# Altium schematic sheet Probe-Scope Top v1.0.SchDoc: Probe-Scope: Overview
size Letter; CompanyName: Probe-Scope; Organization: Probe-Scope; Address1: Probe-Scope: Unified USB; Address2: Oscilloscope Probe; Address3: ©2019 M. Omo, J. Rowley,; SheetNumber: 1; PageSetup: Record=PageOptions|CenterHorizontal=True|CenterVertical=True|PrintScale=0.96|XCorrection=1.00|YCorrection=1.00|PrintKind=1|BorderSize=5000000|LeftOffset=0|BottomOffset=0|Orientation=2|PaperLength=1000|PaperWidth=1000|Scale=100|PaperSource=7|PrintQuality=-4|MediaType=1|DitherType=10|PaperKind=11x17|PrintScaleMode=1; Address4: K. Hall, released under the; License: CERN OHL v1.2
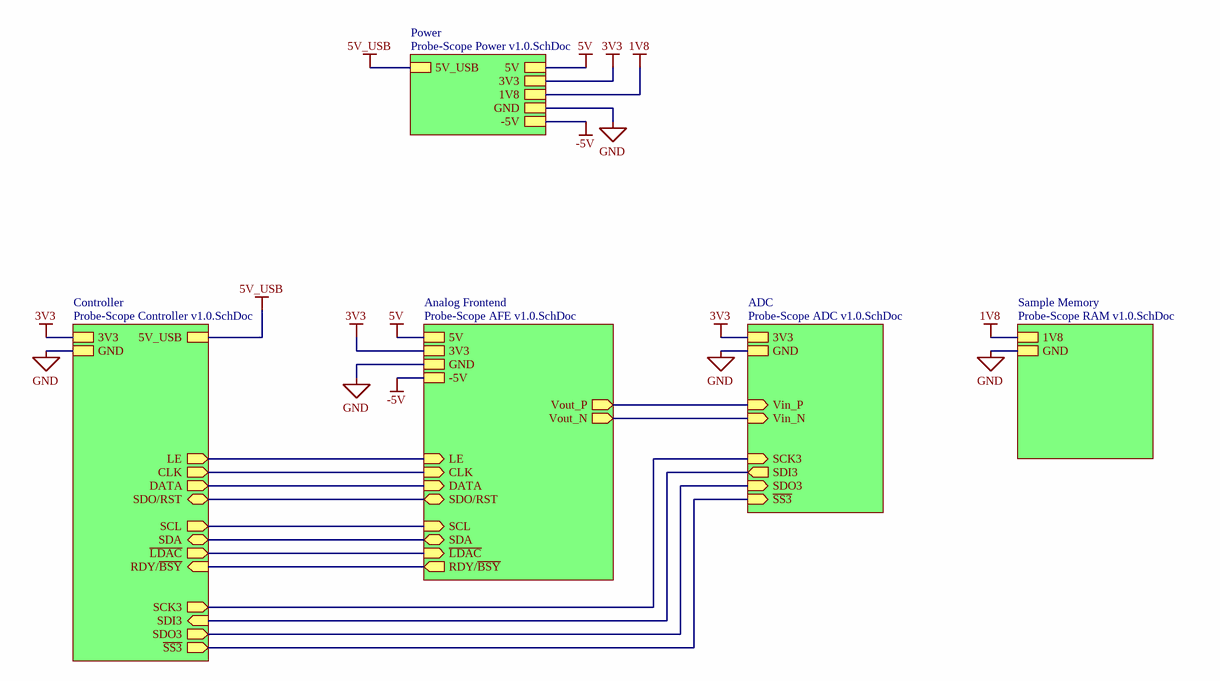
[diagram p0: Probe-Scope Top v1.0.SchDoc]

## Sub-sheets
ADC = Probe-Scope ADC v1.0.SchDoc: Vin_P (in), Vin_N (in), 3V3, GND, SDO3 (in), ~{SS3} (in), SDI3 (out), SCK3 (in)
Analog Frontend = Probe-Scope AFE v1.0.SchDoc: -5V, Vout_N (out), RDY/~{BSY} (out), CLK (in), Vout_P (out), GND, ~{LDAC} (in), SDA (bidir), DATA (in), 3V3, LE (in), 5V, SDO/RST (bidir), SCL (in)
Controller = Probe-Scope Controller v1.0.SchDoc: SCK3 (out), SDO3 (out), SDO/RST (bidir), DATA (out), ~{LDAC} (out), ~{SS3} (out), SDI3 (in), SCL (out), CLK (out), RDY/~{BSY} (in), SDA (bidir), LE (out), 3V3, GND, 5V_USB
Power = Probe-Scope Power v1.0.SchDoc: 3V3, 5V_USB, 5V, -5V, 1V8, GND
Sample Memory = Probe-Scope RAM v1.0.SchDoc: GND, 1V8

## Nets
1V8: sheet Sample Memory/1V8, sheet Power/1V8
3V3: sheet Analog Frontend/3V3, sheet ADC/3V3, sheet Controller/3V3, sheet Power/3V3
5V: sheet Analog Frontend/5V, sheet Power/5V
5V_USB: sheet Controller/5V_USB, sheet Power/5V_USB
-5V: sheet Analog Frontend/-5V, sheet Power/-5V
GND: sheet Analog Frontend/GND, sheet ADC/GND, sheet Sample Memory/GND, sheet Controller/GND, sheet Power/GND
(unnamed): sheet Analog Frontend/Vout_N, sheet ADC/Vin_N
(unnamed): sheet Analog Frontend/RDY/~{BSY}, sheet Controller/RDY/~{BSY}
(unnamed): sheet Analog Frontend/CLK, sheet Controller/CLK
(unnamed): sheet Analog Frontend/Vout_P, sheet ADC/Vin_P
(unnamed): sheet Analog Frontend/~{LDAC}, sheet Controller/~{LDAC}
(unnamed): sheet Analog Frontend/SDA, sheet Controller/SDA
(unnamed): sheet Analog Frontend/DATA, sheet Controller/DATA
(unnamed): sheet Analog Frontend/LE, sheet Controller/LE
(unnamed): sheet Analog Frontend/SDO/RST, sheet Controller/SDO/RST
(unnamed): sheet Analog Frontend/SCL, sheet Controller/SCL
(unnamed): sheet ADC/SDO3, sheet Controller/SDO3
(unnamed): sheet ADC/~{SS3}, sheet Controller/~{SS3}
(unnamed): sheet ADC/SDI3, sheet Controller/SDI3
(unnamed): sheet ADC/SCK3, sheet Controller/SCK3

## Notes on the sheet
- Title:
- Asm:
- Date:
- Variant:
- Time:
- Number:
- Sheet
- of
- Rev:
- File: